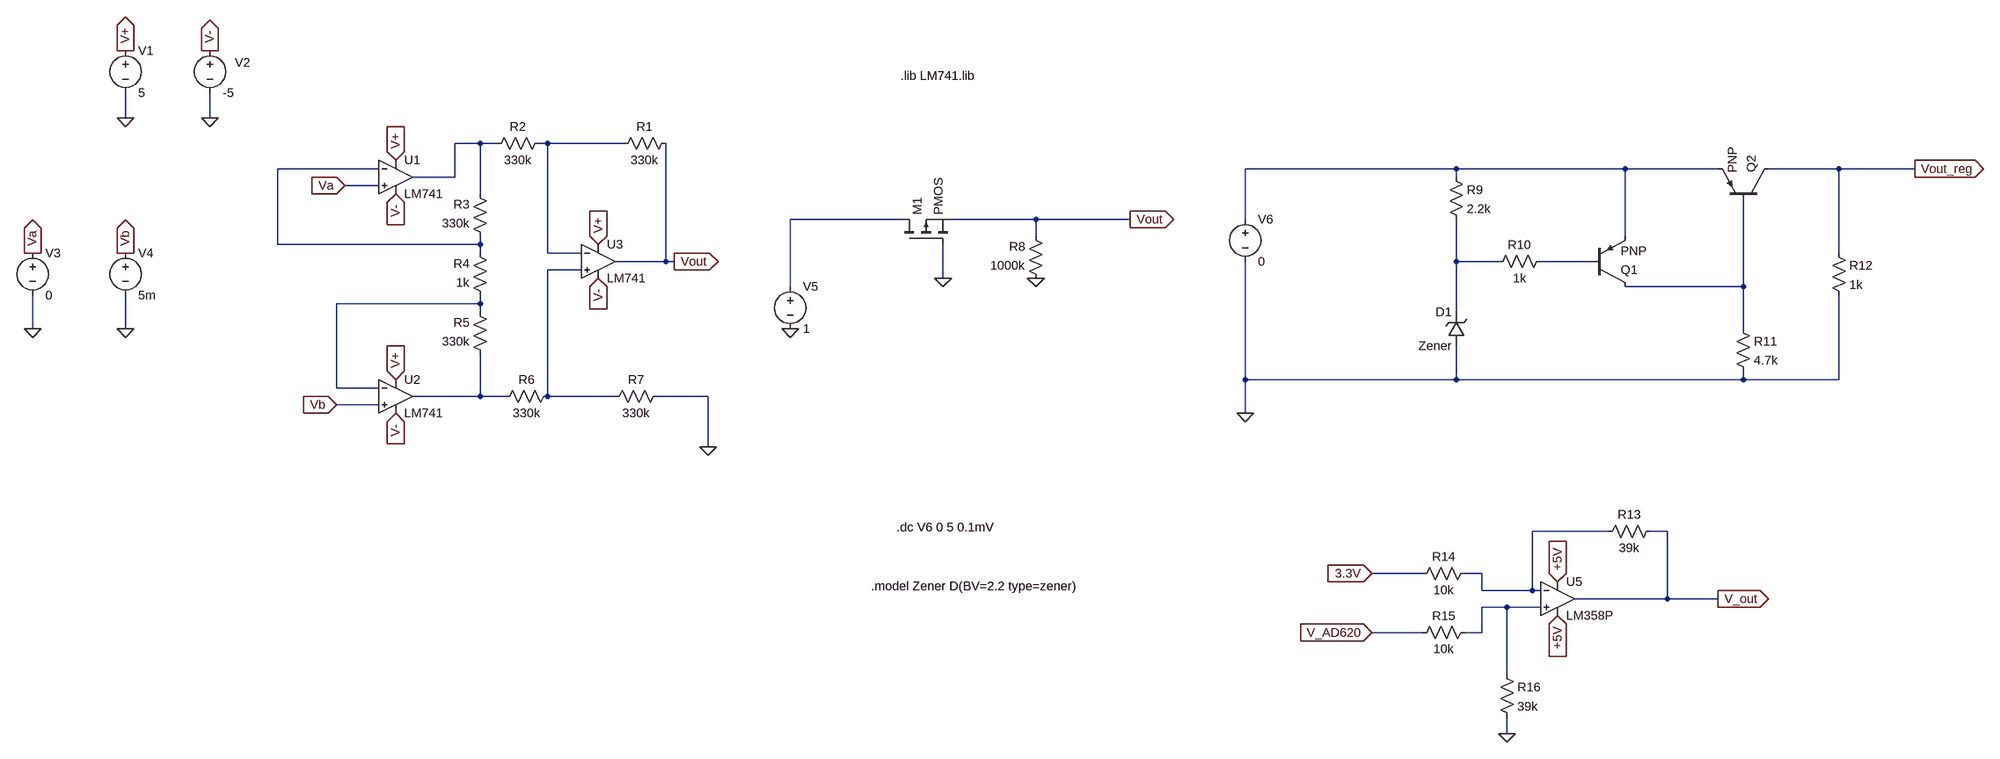
[diagram p0: schematic Full System.asc]
Full System.asc, the LTspice schematic file:
Version 4
SHEET 1 3412 1588
WIRE -672 240 -672 192
WIRE -512 240 -512 192
WIRE 0 288 -48 288
WIRE 32 288 0 288
WIRE 128 288 112 288
WIRE 272 288 128 288
WIRE -192 336 -384 336
WIRE 2352 336 1952 336
WIRE 2672 336 2352 336
WIRE 2848 336 2672 336
WIRE 3104 336 2944 336
WIRE 3248 336 3104 336
WIRE -48 352 -48 288
WIRE -48 352 -128 352
WIRE 2352 352 2352 336
WIRE -192 368 -256 368
WIRE 0 384 0 288
WIRE 1024 432 736 432
WIRE 1280 432 1120 432
WIRE 1472 432 1280 432
WIRE 1952 432 1952 336
WIRE 1280 464 1280 432
WIRE 2672 464 2672 336
WIRE -384 480 -384 336
WIRE 0 480 0 464
WIRE 0 480 -384 480
WIRE 0 496 0 480
WIRE 128 496 128 288
WIRE 192 496 128 496
WIRE 3104 496 3104 336
WIRE 352 512 352 288
WIRE 352 512 256 512
WIRE 368 512 352 512
WIRE 2352 512 2352 432
WIRE 2432 512 2352 512
WIRE 2608 512 2512 512
WIRE 192 528 128 528
WIRE 1104 544 1104 480
WIRE 736 560 736 432
WIRE 2896 560 2896 400
WIRE 2896 560 2672 560
WIRE 0 592 0 576
WIRE 0 592 -272 592
WIRE 0 608 0 592
WIRE 2352 608 2352 512
WIRE -848 640 -848 576
WIRE -672 640 -672 576
WIRE 2896 640 2896 560
WIRE 1952 736 1952 512
WIRE 2352 736 2352 672
WIRE 2352 736 1952 736
WIRE 2896 736 2896 720
WIRE 2896 736 2352 736
WIRE 3104 736 3104 576
WIRE 3104 736 2896 736
WIRE -272 752 -272 592
WIRE -192 752 -272 752
WIRE 0 768 0 688
WIRE 0 768 -128 768
WIRE 48 768 0 768
WIRE 128 768 128 528
WIRE 256 768 128 768
WIRE 432 768 336 768
WIRE -192 784 -272 784
WIRE 1952 800 1952 736
WIRE 432 864 432 768
WIRE 2640 1184 2496 1184
WIRE 2752 1184 2720 1184
WIRE 2288 1264 2192 1264
WIRE 2400 1264 2368 1264
WIRE 2400 1296 2400 1264
WIRE 2496 1296 2496 1184
WIRE 2496 1296 2400 1296
WIRE 2512 1296 2496 1296
WIRE 2752 1312 2752 1184
WIRE 2752 1312 2576 1312
WIRE 2848 1312 2752 1312
WIRE 2448 1328 2400 1328
WIRE 2512 1328 2448 1328
WIRE 2288 1376 2192 1376
WIRE 2400 1376 2400 1328
WIRE 2400 1376 2368 1376
WIRE 2448 1456 2448 1328
WIRE 2448 1568 2448 1536
FLAG -160 320 V+
IOPIN -160 320 In
FLAG -160 384 V-
IOPIN -160 384 In
FLAG -256 368 Va
IOPIN -256 368 In
FLAG -160 736 V+
IOPIN -160 736 In
FLAG -160 800 V-
IOPIN -160 800 In
FLAG 224 480 V+
IOPIN 224 480 In
FLAG 224 544 V-
IOPIN 224 544 In
FLAG 368 512 Vout
IOPIN 368 512 Out
FLAG 432 864 0
FLAG -272 784 Vb
IOPIN -272 784 In
FLAG -672 240 0
FLAG -512 240 0
FLAG -672 112 V+
IOPIN -672 112 Out
FLAG -512 112 V-
IOPIN -512 112 Out
FLAG -848 640 0
FLAG -672 640 0
FLAG -848 496 Va
IOPIN -848 496 Out
FLAG -672 496 Vb
IOPIN -672 496 Out
FLAG 736 640 0
FLAG 1104 544 0
FLAG 1472 432 Vout
IOPIN 1472 432 Out
FLAG 1280 544 0
FLAG 1952 800 0
FLAG 3248 336 Vout_reg
IOPIN 3248 336 Out
FLAG 2448 1568 0
FLAG 2848 1312 V_out
IOPIN 2848 1312 Out
FLAG 2192 1376 V_AD620
IOPIN 2192 1376 In
FLAG 2192 1264 3.3V
IOPIN 2192 1264 In
FLAG 2544 1280 +5V
IOPIN 2544 1280 In
FLAG 2544 1344 +5V
IOPIN 2544 1344 In
SYMBOL OpAmps\\opamp2 -160 288 R0
SYMATTR InstName U1
SYMATTR Value LM741
SYMBOL OpAmps\\opamp2 -160 704 R0
SYMATTR InstName U2
SYMATTR Value LM741
SYMBOL OpAmps\\opamp2 224 448 R0
SYMATTR InstName U3
SYMATTR Value LM741
SYMBOL res 368 272 R90
WINDOW 0 0 56 VBottom 2
WINDOW 3 32 56 VTop 2
SYMATTR InstName R1
SYMATTR Value 330k
SYMBOL res 128 272 R90
WINDOW 0 0 56 VBottom 2
WINDOW 3 32 56 VTop 2
SYMATTR InstName R2
SYMATTR Value 330k
SYMBOL res 16 480 R180
WINDOW 0 36 76 Left 2
WINDOW 3 36 40 Left 2
SYMATTR InstName R3
SYMATTR Value 330k
SYMBOL res 16 592 R180
WINDOW 0 36 76 Left 2
WINDOW 3 36 40 Left 2
SYMATTR InstName R4
SYMATTR Value 1k
SYMBOL res 16 704 R180
WINDOW 0 36 76 Left 2
WINDOW 3 36 40 Left 2
SYMATTR InstName R5
SYMATTR Value 330k
SYMBOL res 144 752 R90
WINDOW 0 0 56 VBottom 2
WINDOW 3 32 56 VTop 2
SYMATTR InstName R6
SYMATTR Value 330k
SYMBOL res 352 752 R90
WINDOW 0 0 56 VBottom 2
WINDOW 3 32 56 VTop 2
SYMATTR InstName R7
SYMATTR Value 330k
SYMBOL voltage -672 96 R0
WINDOW 123 0 0 Left 0
WINDOW 39 0 0 Left 0
SYMATTR InstName V1
SYMATTR Value 5
SYMBOL voltage -512 96 R0
WINDOW 0 47 39 Left 2
WINDOW 123 0 0 Left 0
WINDOW 39 0 0 Left 0
SYMATTR InstName V2
SYMATTR Value -5
SYMBOL voltage -848 480 R0
WINDOW 123 0 0 Left 0
WINDOW 39 0 0 Left 0
SYMATTR InstName V3
SYMATTR Value 0
SYMBOL voltage -672 480 R0
WINDOW 123 0 0 Left 0
WINDOW 39 0 0 Left 0
SYMATTR InstName V4
SYMATTR Value 5m
SYMBOL pmos 1024 480 R270
SYMATTR InstName M1
SYMBOL voltage 736 544 R0
WINDOW 123 0 0 Left 0
WINDOW 39 0 0 Left 0
SYMATTR InstName V5
SYMATTR Value 1
SYMBOL res 1296 560 R180
WINDOW 0 36 76 Left 2
WINDOW 3 36 40 Left 2
SYMATTR InstName R8
SYMATTR Value 1000k
SYMBOL voltage 1952 416 R0
WINDOW 123 0 0 Left 0
WINDOW 39 0 0 Left 0
SYMATTR InstName V6
SYMATTR Value 0
SYMBOL res 2336 336 R0
SYMATTR InstName R9
SYMATTR Value 2.2k
SYMBOL res 2528 496 R90
WINDOW 0 0 56 VBottom 2
WINDOW 3 32 56 VTop 2
SYMATTR InstName R10
SYMATTR Value 1k
SYMBOL pnp 2944 400 M270
SYMATTR InstName Q2
SYMBOL res 2880 624 R0
SYMATTR InstName R11
SYMATTR Value 4.7k
SYMBOL pnp 2608 560 M180
SYMATTR InstName Q1
SYMBOL res 3088 480 R0
SYMATTR InstName R12
SYMATTR Value 1k
SYMBOL zener 2368 672 R180
WINDOW 0 24 64 Left 2
WINDOW 3 24 0 Left 2
SYMATTR InstName D1
SYMATTR Value Zener
SYMBOL res 2736 1168 R90
WINDOW 0 0 56 VBottom 2
WINDOW 3 32 56 VTop 2
SYMATTR InstName R13
SYMATTR Value 39k
SYMBOL res 2384 1248 R90
WINDOW 0 0 56 VBottom 2
WINDOW 3 32 56 VTop 2
SYMATTR InstName R14
SYMATTR Value 10k
SYMBOL res 2384 1360 R90
WINDOW 0 0 56 VBottom 2
WINDOW 3 32 56 VTop 2
SYMATTR InstName R15
SYMATTR Value 10k
SYMBOL res 2432 1440 R0
SYMATTR InstName R16
SYMATTR Value 39k
SYMBOL OpAmps\\opamp2 2544 1248 R0
SYMATTR InstName U5
SYMATTR Value LM358P
TEXT 1024 160 Left 2 !.lib LM741.lib
TEXT 968 1288 Left 2 !.model Zener D(BV=2.2 type=zener)
TEXT 1016 1176 Left 2 !.dc V6 0 5 0.1mV

The netlist it stands for:
* Full System.asc
XU1 Va N003 V+ V- N001 LM741  ; pins In+ In- V+ V- OUT
XU2 Vb N010 V+ V- N011 LM741  ; pins In+ In- V+ V- OUT
XU3 N008 N002 V+ V- Vout LM741  ; pins In+ In- V+ V- OUT
R1 Vout N002 330k
R2 N002 N001 330k
R3 N003 N001 330k
R4 N010 N003 1k
R5 N011 N010 330k
R6 N008 N011 330k
R7 0 N008 330k
V1 V+ 0 5
V2 V- 0 -5
V3 Va 0 0
V4 Vb 0 5m
M1 N005 0 Vout Vout PMOS
V5 N005 0 1
R8 0 Vout 1000k
V6 N004 0 0
R9 N004 N006 2.2k
R10 N007 N006 1k
Q2 Vout_reg N009 N004 0 PNP
R11 N009 0 4.7k
Q1 N009 N007 N004 0 PNP
R12 Vout_reg 0 1k
D1 0 N006 Zener
R13 V_out N012 39k
R14 N012 3.3V 10k
R15 N013 V_AD620 10k
R16 N013 0 39k
XU5 N013 N012 +5V +5V V_out LM358P  ; pins In+ In- V+ V- OUT
.model D D
.lib standard.dio
.model NPN NPN
.model PNP PNP
.lib standard.bjt
.model NMOS NMOS
.model PMOS PMOS
.lib standard.mos
.lib LM741.lib
.model Zener D(BV=2.2 type=zener)
.dc V6 0 5 0.1mV
.backanno
.end